# Altium schematic sheet 018_RTC & ID & DEBUG.SchDoc
size 420 x 297 mm; Page Create Date: May 29, 2006; WebSite: https://www.seeedstudio.com; Variant Name: <Core Design>; Page Number: 18; Drawing: qxn; Schematic Name: BeaglePlay; Page Size: A3; Comment: Seeed Title; Page Count: 22; Page Name: 018_RTC & ID & DEBUG; Company: Seeed Studio; RevCode: v0.2; DsnPath: C:\Users\a0488739\Documents\GitHub\beagleplay\allegro\DVT\BEAGLEPLAYV020_220915.DSN; SchematicName: BeaglePlay; PageName: 018_RTC & ID & DEBUG; PageSize: A3; TopSchematic: True
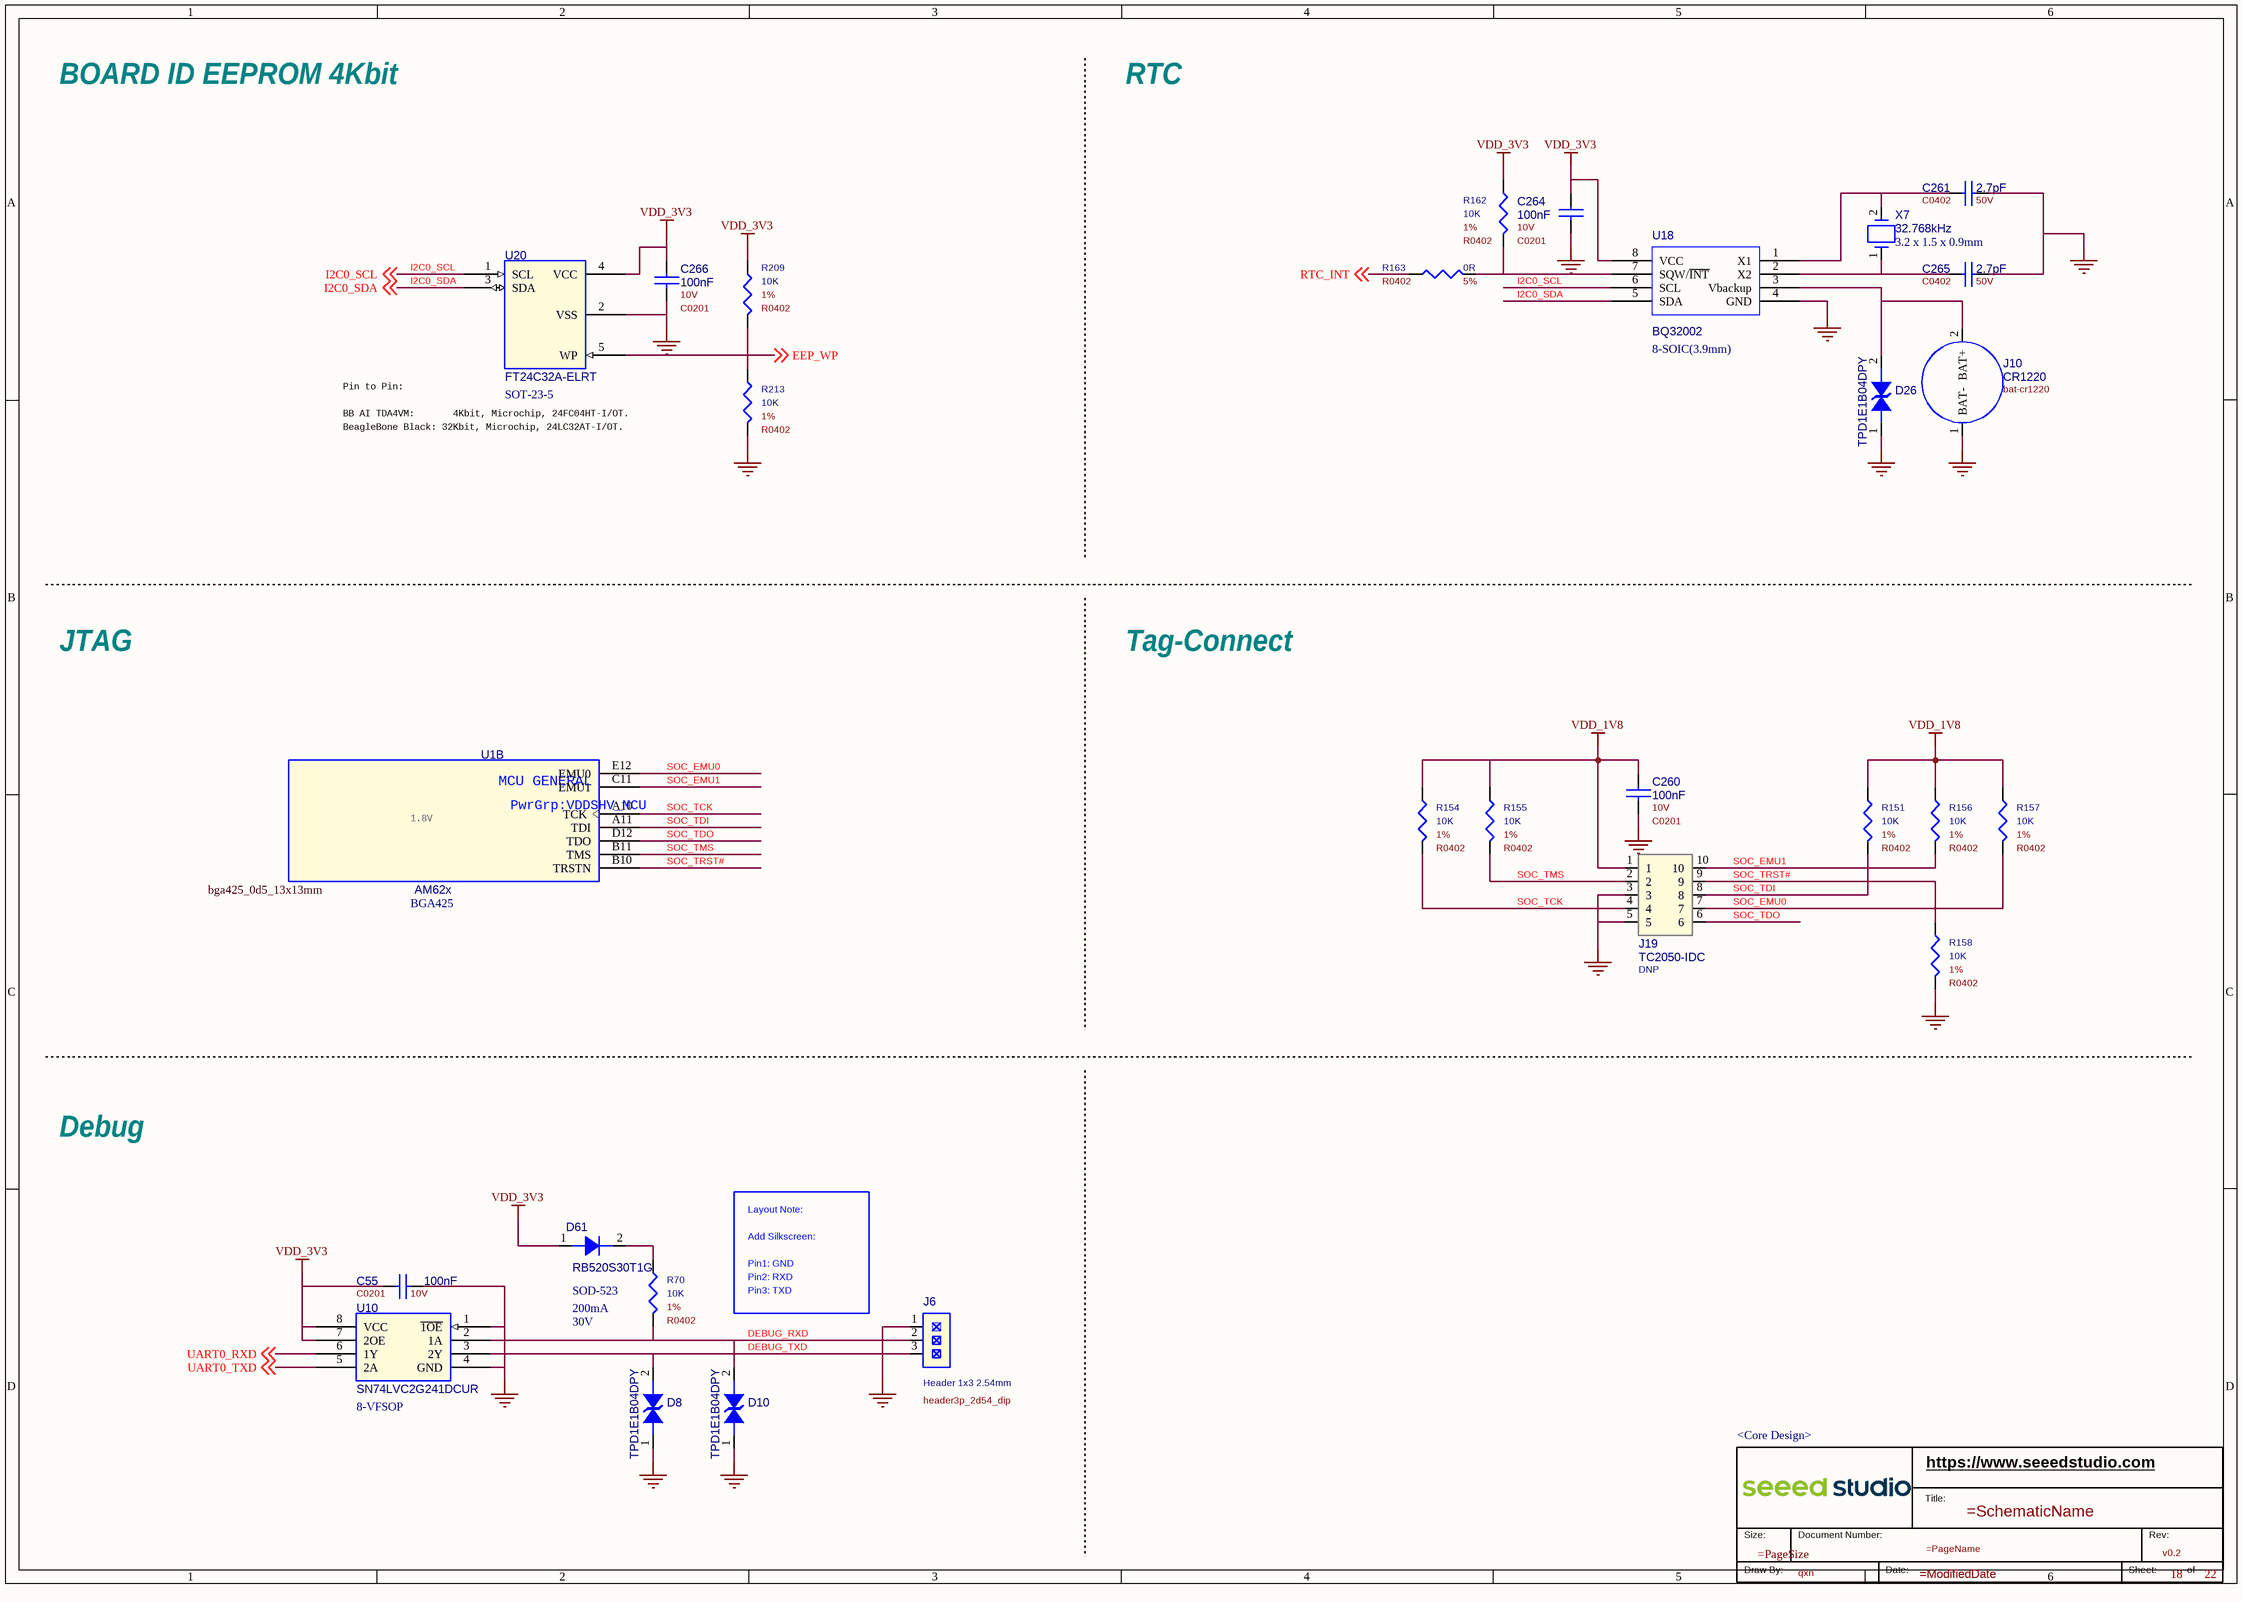
[diagram p0: 018_RTC & ID & DEBUG.SchDoc]

## Parts
*  RevCode: v0.2  Page Number: 18  Page Count: 22  Drawing: qxn  Variant Name: <Core Design>  (hidden comment: Seeed Title)  (graphical)
C55  value 100nF  Rating: 10V  [C0201]  (hidden comment: CC)
C260  value 100nF  Rating: 10V  [C0201]  (hidden comment: CC)
C261  value 2.7pF  Rating: 50V  [C0402]  (hidden comment: CC)
C264  value 100nF  Rating: 10V  [C0201]  (hidden comment: CC)
C265  value 2.7pF  Rating: 50V  [C0402]  (hidden comment: CC)
C266  value 100nF  Rating: 10V  [C0201]  (hidden comment: CC)
D8  value TPD1E1B04DPY  [D0402]  (hidden comment: DIODE TVS BI-DIR)
D10  value TPD1E1B04DPY  [D0402]  (hidden comment: DIODE TVS BI-DIR)
D26  value TPD1E1B04DPY  [D0402]  (hidden comment: DIODE TVS BI-DIR)
D61  value RB520S30T1G  Repetitive Reverse Voltage Maximum: 30V  Peak Forward Current: 200mA  Package Size: SOD-523  [sod_523]  (hidden comment: D)
J6  value Header 1x3 2.54mm  [header3p_2d54_dip]  (hidden comment: Header 1x3)
J10  value CR1220  [bat-cr1220]  (hidden comment: BAT Holder 2P)
J19  value TC2050-IDC  ASSY: DNP  [Connect10_1d27_12_4x6_7mm]  (hidden comment: Header 2X5_1)
R70  value 10K  Rating: 1%  [R0402]  (hidden comment: R)
R151  value 10K  Rating: 1%  [R0402]  (hidden comment: R)
R154  value 10K  Rating: 1%  [R0402]  (hidden comment: R)
R155  value 10K  Rating: 1%  [R0402]  (hidden comment: R)
R156  value 10K  Rating: 1%  [R0402]  (hidden comment: R)
R157  value 10K  Rating: 1%  [R0402]  (hidden comment: R)
R158  value 10K  Rating: 1%  [R0402]  (hidden comment: R)
R162  value 10K  Rating: 1%  [R0402]  (hidden comment: R)
R163  value 0R  Rating: 5%  [R0402]  (hidden comment: R)
R209  value 10K  Rating: 1%  [R0402]  (hidden comment: R)
R213  value 10K  Rating: 1%  [R0402]  (hidden comment: R)
U1  value AM62x  Package Size: BGA425  [bga425_0d5_13x13mm]  (hidden comment: AM62x_BGA425)  (part B of 19)
U10  value SN74LVC2G241DCUR  Package Size: 8-VFSOP  [U_8_DCU]  (hidden comment: SN74LVC2G241)
U18  value BQ32002  Package Size: 8-SOIC(3.9mm)  [soic8_1d27_4_9x3_9mm]  (hidden comment: DS1339_8P)
U20  value FT24C32A-ELRT  Package Size: SOT-23-5  [sot23-5]  (hidden comment: MEM_24LC32_SOT23-5)
X7  value 32.768kHz  Package Size: 3.2 x 1.5 x 0.9mm  [X2_SMD_3_2X1_5MM]  (hidden comment: XTAL_2P)

## Nets
GND: C55.2 C260.2 C261.2 C264.2 C265.2 C266.2 D8.1 D10.1 D26.1 J6.1 J10.1(BAT-) J19.3 J19.5 R158.2 R213.2 U10.1(~{1OE}) U10.4(GND) U18.4(GND) U20.2(VSS)
VDD_1V8: C260.1 J19.1 R151.1 R154.1 R155.1 R156.1 R157.1
VDD_3V3: C55.1 C264.1 C266.1 D61.1(A) R162.1 R209.1 U10.7(2OE) U10.8(VCC) U18.8(VCC) U20.4(VCC)
DEBUG_RXD: D10.2 J6.2 R70.2 U10.2(1A)
DEBUG_TXD: D8.2 J6.3 U10.3(2Y)
EEP_WP: R209.2 R213.1 U20.5(WP) ; off-sheet EEP_WP
I2C0_SCL: U18.6(SCL) U20.1(SCL) ; off-sheet I2C0_SCL
I2C0_SDA: U18.5(SDA) U20.3(SDA) ; off-sheet I2C0_SDA
RTC_INT: R163.1 ; off-sheet RTC_INT
SOC_EMU0: J19.7 R157.2 U1.E12(EMU0)
SOC_EMU1: J19.10 R156.2 U1.C11(EMU1)
SOC_TCK: J19.4 R154.2 U1.A10(TCK)
SOC_TDI: J19.8 R151.2 U1.A11(TDI)
SOC_TDO: J19.6 U1.D12(TDO)
SOC_TMS: J19.2 R155.2 U1.B11(TMS)
SOC_TRST#: J19.9 R158.1 U1.B10(TRSTN)
UART0_RXD: U10.6(1Y) ; off-sheet UART0_RXD
UART0_TXD: U10.5(2A) ; off-sheet UART0_TXD
NetC261_1: C261.1 U18.1(X1) X7.2
NetC265_1: C265.1 U18.2(X2) X7.1
NetD26_2: D26.2 J10.2(BAT+) U18.3(Vbackup)
NetD61_2: D61.2(C) R70.1
NetR162_2: R162.2 R163.2 U18.7(SQW/~{INT})

## Notes on the sheet
- BOARD ID EEPROM 4Kbit
- RTC
- Pin to Pin:
- BB AI TDA4VM:       4Kbit, Microchip, 24FC04HT-I/OT.
- BeagleBone Black: 32Kbit, Microchip, 24LC32AT-I/OT.
- JTAG
- Tag-Connect
- 1.8V
- Debug
- Add Silkscreen:
- Layout Note:
- Pin1: GND
- Pin2: RXD
- Pin3: TXD
- (in symbol AM62x_BGA425, part B) MCU GENERAL; PwrGrp:VDDSHV_MCU
- (in symbol Seeed Title) https://www.seeedstudio.com; Title:; Size:; Document Number:; Rev:; Draw By:; Date:; Sheet:; of

## Library data of the parts
* = Seeed Title: Company: Seeed Studio; WebSite: https://www.seeedstudio.com; Schematic Name: =SchematicName; Page Size: =PageSize; Page Name: =PageName; Page Create Date: May 29, 2006; Page Modify Date: =ModifiedDate
C55 = CC: CAP, Ceramic, SMD, 100nF, 10%, 10V, 0201; Part Reference: C55; Manufacturer: YAGEO; Manufacturer Part Number: CC0201KRX5R6BB104; Company Part Status: ODYSSEY-i.MX8M; PN: 302010271; Temperature Coefficient: X5R; CLASS: DISCRETE; PCB Footprint: C0201; Part Type: Ceramic; Status: ODYSSEY-i.MX8M; Temperature: -55¡ãC to 85¡ãC; Package Size: 0201; Dielectric Type: Ceramic; Tolerance: 10%; Manufacturer PN: CC0201KRX5R6BB104
C260 = CC: CAP, Ceramic, SMD, 100nF, 10%, 10V, 0201; Part Reference: C260; Manufacturer Part Number: CC0201KRX5R6BB104; Manufacturer: YAGEO; Company Part Status: ODYSSEY-i.MX8M; PN: 302010271; Temperature Coefficient: X5R; CLASS: DISCRETE; PCB Footprint: C0201; Temperature: -55¡ãC to 85¡ãC; Status: ODYSSEY-i.MX8M; Part Type: Ceramic; Package Size: 0201; Dielectric Type: Ceramic; Tolerance: 10%; Manufacturer PN: CC0201KRX5R6BB104
C261 = CC: CAP, Ceramic, SMD, 2.7pF, 0.25pF, 50V, 0402; Part Reference: C261; Manufacturer PN: GCM1555C1H2R7CA16D; Manufacturer: Murata; Company Part Status: Combox Pro; Manufacturer Part Number: Murata;GCM1555C1H2R7CA16D; CLASS: DISCRETE; Temperature Coefficient: NP0; PN: 302011569; SIGNAL_MODEL: DEFAULT_CAPACITOR_22.000000pF_1_2; PCB Footprint: C0402; Tolerance: 0.25pF; Dielectric Type: Ceramic; Package Size: 0402; Status: Combox Pro; Part Type: Ceramic
C264 = CC: CAP, Ceramic, SMD, 100nF, 10%, 10V, 0201; Part Reference: C264; Manufacturer PN: CC0201KRX5R6BB104; Manufacturer: YAGEO; Company Part Status: ODYSSEY-i.MX8M; Manufacturer Part Number: Murata;GRM155R71C104KA88D; CLASS: DISCRETE; Temperature Coefficient: X5R; PN: 302010271; SIGNAL_MODEL: DEFAULT_CAPACITOR_100000pF_1_2; PCB Footprint: C0201; Tolerance: 10%; Dielectric Type: Ceramic; Package Size: 0201; Part Type: Ceramic; Status: Combox Pro
C265 = CC: CAP, Ceramic, SMD, 2.7pF, 0.25pF, 50V, 0402; Part Reference: C265; Manufacturer PN: GCM1555C1H2R7CA16D; Manufacturer: Murata; Company Part Status: Combox Pro; Manufacturer Part Number: Murata;GCM1555C1H2R7CA16D; CLASS: DISCRETE; Temperature Coefficient: NP0; PN: 302011569; SIGNAL_MODEL: DEFAULT_CAPACITOR_22.000000pF_1_2; PCB Footprint: C0402; Tolerance: 0.25pF; Dielectric Type: Ceramic; Package Size: 0402; Part Type: Ceramic; Status: Combox Pro
C266 = CC: CAP, Ceramic, SMD, 100nF, 10%, 10V, 0201; Part Reference: C266; Manufacturer PN: CC0201KRX5R6BB104; Company Part Status: ODYSSEY-i.MX8M; Manufacturer: YAGEO; CLASS: DISCRETE; Temperature Coefficient: X5R; PN: 302010271; PCB Footprint: C0201; Tolerance: 10%; Dielectric Type: Ceramic; Package Size: 0201; Manufacturer Part Number: CC0201KRX5R6BB104; Part Type: Ceramic; Status: ODYSSEY-i.MX8M; Temperature: -55¡ãC to 85¡ãC
D8 = DIODE TVS BI-DIR: DIO, ESD, TPD1E1B04DPY, --, 3.6V, --, X1SON(2); Part Reference: D8; Manufacturer: TI; Manufacturer Part Number: TPD1E1B04DPYR/T; Company Part Status: Grove Base Cape for PocketBeagle; Manufacturer PN: TPD1E1B04DPYR; PN: 304050798; CLASS: DISCRETE; PCB Footprint: D0402; Part Type: ESD; Status: Grove Base Cape for PocketBeagle; Temperature: -40¡ãC to 125¡ãC; Package Size: X1SON(2); Rated Voltage: 3.6V
D10 = DIODE TVS BI-DIR: DIO, ESD, TPD1E1B04DPY, --, 3.6V, --, X1SON(2); Part Reference: D10; Manufacturer: TI; Manufacturer Part Number: TPD1E1B04DPYR/T; Company Part Status: Grove Base Cape for PocketBeagle; Manufacturer PN: TPD1E1B04DPYR; PN: 304050798; CLASS: DISCRETE; PCB Footprint: D0402; Part Type: ESD; Status: Grove Base Cape for PocketBeagle; Temperature: -40¡ãC to 125¡ãC; Package Size: X1SON(2); Rated Voltage: 3.6V
D26 = DIODE TVS BI-DIR: DIO, ESD, TPD1E1B04DPY, --, 3.6V, --, X1SON(2); Part Reference: D26; Manufacturer Part Number: TPD1E1B04DPYR/T; Manufacturer: TI; Company Part Status: Grove Base Cape for PocketBeagle; Manufacturer PN: TPD1E1B04DPYR; PN: 304050798; CLASS: DISCRETE; PCB Footprint: D0402; Temperature: -40¡ãC to 125¡ãC; Status: Grove Base Cape for PocketBeagle; Part Type: ESD; Package Size: X1SON(2); Rated Voltage: 3.6V
D61 = D: DIO, Schottky, RB520S30T1G, , , , SOD-523; Part Reference: D61; Manufacturer: ON; Company Part Status: SCG Vehicle Device; CLASS: DISCRETE; PN: 304020782; PCB Footprint: sod_523; Manufacturer PN: RB520S30T1G
J6 = Header 1x3: CONN, Header, 1*3P, DIP; Part Reference: J6; Company Part Status: ST; Manufacturer: Yuxi Electronics; Manufacturer PN: P125-1103A1BS116A1; PN: 320020079; CLASS: IO; PCB Footprint: header3p_2d54_dip; Package Size: 1*3P-2.54-2.54-11.6/3.0mm
J10 = BAT Holder 2P: CONN, BAT Holder, , SMD; Part Reference: J10; Company Part Status: BeagleBone Carrier Board; Manufacturer: HongKeWei; Manufacturer PN: BS-12-B3AA003; PN: 320170000; CLASS: IO; PCB Footprint: bat-cr1220; Package Size: CR1220-15.06*13.00*H4.1mm
J19 = Header 2X5_1: CONN, Header, TC2050-IDC, 2*5P, SMD; Part Reference: J19; Company Part Status: RV PI; PN: TMP-43; CLASS: IO; PCB Footprint: Connect10_1d27_12_4x6_7mm
R70 = R: RES, Thick Film, 10K, 1%, 1/16W, SMD, 0402; Part Reference: R70; Manufacturer PN: RC0402FR-0710KL; Company Part Status: BeagleBone Carrier Board; Manufacturer Part Number: RC0402FR-074K7L; Manufacturer: YAGEO; CLASS: DISCRETE; PN: 301010047; PCB Footprint: R0402; Rated Power: 1/16W; Package Size: 0402; Temperature: -55¡ãC to 155¡ãC; Status: BeagleBone Carrier Board; Part Type: RES
R151 = R: RES, Thick Film, 10K, 1%, 1/16W, SMD, 0402; Part Reference: R151; Manufacturer PN: RC0402FR-0710KL; Company Part Status: BeagleBone Carrier Board; Manufacturer: YAGEO; Manufacturer Part Number: RC0201FR-0710KL; CLASS: DISCRETE; PN: 301010047; PCB Footprint: R0402; Rated Power: 1/16W; Package Size: 0402; Part Type: RES; Status: BeagleBone AI TDA4VM; Temperature: -55¡ãC to 125¡ãC
R154 = R: RES, Thick Film, 10K, 1%, 1/16W, SMD, 0402; Part Reference: R154; Manufacturer: YAGEO; Manufacturer Part Number: RC0402FR-074K7L; Company Part Status: BeagleBone Carrier Board; Manufacturer PN: RC0402FR-0710KL; PN: 301010047; CLASS: DISCRETE; PCB Footprint: R0402; Rated Power: 1/16W; Part Type: RES; Status: BeagleBone Carrier Board; Temperature: -55¡ãC to 155¡ãC; Package Size: 0402
R155 = R: RES, Thick Film, 10K, 1%, 1/16W, SMD, 0402; Part Reference: R155; Manufacturer: YAGEO; Manufacturer Part Number: RC0402FR-074K7L; Company Part Status: BeagleBone Carrier Board; Manufacturer PN: RC0402FR-0710KL; PN: 301010047; CLASS: DISCRETE; PCB Footprint: R0402; Rated Power: 1/16W; Part Type: RES; Status: BeagleBone Carrier Board; Temperature: -55¡ãC to 155¡ãC; Package Size: 0402
R156 = R: RES, Thick Film, 10K, 1%, 1/16W, SMD, 0402; Part Reference: R156; Manufacturer PN: RC0402FR-0710KL; Company Part Status: BeagleBone Carrier Board; Manufacturer: YAGEO; Manufacturer Part Number: RC0201FR-0710KL; CLASS: DISCRETE; PN: 301010047; PCB Footprint: R0402; Rated Power: 1/16W; Package Size: 0402; Part Type: RES; Status: BeagleBone AI TDA4VM; Temperature: -55¡ãC to 125¡ãC
R157 = R: RES, Thick Film, 10K, 1%, 1/16W, SMD, 0402; Part Reference: R157; Manufacturer PN: RC0402FR-0710KL; Company Part Status: BeagleBone Carrier Board; Manufacturer Part Number: RC0201FR-0710KL; Manufacturer: YAGEO; CLASS: DISCRETE; PN: 301010047; PCB Footprint: R0402; Rated Power: 1/16W; Package Size: 0402; Temperature: -55¡ãC to 125¡ãC; Status: BeagleBone AI TDA4VM; Part Type: RES
R158 = R: RES, Thick Film, 10K, 1%, 1/16W, SMD, 0402; Part Reference: R158; Manufacturer PN: RC0402FR-0710KL; Company Part Status: BeagleBone Carrier Board; Manufacturer: YAGEO; Manufacturer Part Number: RC0402FR-074K7L; CLASS: DISCRETE; PN: 301010047; PCB Footprint: R0402; Rated Power: 1/16W; Package Size: 0402; Part Type: RES; Status: BeagleBone Carrier Board; Temperature: -55¡ãC to 155¡ãC
R162 = R: RES, Thick Film, 10K, 1%, 1/16W, SMD, 0402; Part Reference: R162; Manufacturer PN: RC0402FR-0710KL; Manufacturer: YAGEO; Company Part Status: BeagleBone Carrier Board; Manufacturer Part Number: YAGEO;RC0402JR-0710KL; CLASS: DISCRETE; PN: 301010047; SIGNAL_MODEL: DEFAULT_RESISTOR_10000OHM_1_2; PCB Footprint: R0402; Rated Power: 1/16W; Package Size: 0402; Part Type: RES; Status: BeagleBone Carrier Board
R163 = R: RES, Thick Film, 0R, 5%, 1/16W, SMD, 0402; Part Reference: R163; Manufacturer PN: RC0402JR-070RL; Manufacturer: YAGEO; Company Part Status: BeagleBone Carrier Board; Manufacturer Part Number: YAGEO;RC0402JR-070RL; CLASS: DISCRETE; PN: 301010000; SIGNAL_MODEL: DEFAULT_RESISTOR_0.001OHM_1_2; PCB Footprint: R0402; Rated Power: 1/16W; Package Size: 0402; Part Type: RES; Status: BeagleBone Carrier Board
R209 = R: RES, Thick Film, 10K, 1%, 1/16W, SMD, 0402; Part Reference: R209; Manufacturer Part Number: RC0201FR-0710KL; Manufacturer: YAGEO; Company Part Status: BeagleBone Carrier Board; Manufacturer PN: RC0402FR-0710KL; PN: 301010047; CLASS: DISCRETE; PCB Footprint: R0402; Temperature: -55¡ãC to 125¡ãC; Status: BeagleBone AI TDA4VM; Part Type: RES; Package Size: 0402; Rated Power: 1/16W
R213 = R: RES, Thick Film, 10K, 1%, 1/16W, SMD, 0402; Part Reference: R213; Manufacturer PN: RC0402FR-0710KL; Company Part Status: BeagleBone Carrier Board; Manufacturer Part Number: RC0201FR-0710KL; Manufacturer: YAGEO; CLASS: DISCRETE; PN: 301010047; PCB Footprint: R0402; Rated Power: 1/16W; Package Size: 0402; Temperature: -55¡ãC to 125¡ãC; Status: BeagleBone AI TDA4VM; Part Type: RES
U1 = AM62x_BGA425: IC, Controller, MPU, AM62x, BGA425; Part Reference: U1; Manufacturer PN: AM6254ATCGGHALWR; Manufacturer: TI; Company Part Status: BeaglePlay; PN: 310011537; PCB Footprint: bga425_0d5_13x13mm; CLASS: IC
U10 = SN74LVC2G241: IC, Logic, Buffer, SN74LVC2G241DCUR, 8-VFSOP; Part Reference: U10; Manufacturer: TI; Company Part Status: BeagleBone Carrier Board; PN: 310050078; PCB Footprint: U_8_DCU; Temperature: -40¡ãC to 125¡ãC; Status: BeagleBone Carrier Board; Manufacturer Part Number: SN74LVC2G241DCUR; Part Type: Buffer; CLASS: IC; Manufacturer PN: SN74LVC2G241DCUR
U18 = DS1339_8P: IC, Misc, RTC, BQ32002, 8-SOIC(3.9mm); Part Reference: U18; Manufacturer PN: BQ32002DR; Manufacturer: TI; Company Part Status: BeaglePlay; PN: 310110503; PCB Footprint: soic8_1d27_4_9x3_9mm; CLASS: IC
U20 = MEM_24LC32_SOT23-5: IC, Memory Devices, EEPROM, FT24C32A-ELRT, SOT-23-5; Part Reference: U20; Company Part Status: BeagleV-Ahead; Manufacturer: FMD; Manufacturer Part Number: 24FC04HT-I/OT; PN: 310091347; Priority: A; PCB Footprint: sot23-5; Manufacturer PN: FT24C32A-ELRT; CLASS: IC; Part Type: EEPROM; Status: BeagleBone AI TDA4VM; Temperature: -40¡ãC to 85¡ãC
X7 = XTAL_2P: Crystal, SMD, 32.768kHz, 20 ppm, 12.5pF; Part Reference: X7; Manufacturer Part Number: Kyocera;ST3215SB32768H5HPWAA; Company Part Status: BeagleBone Carrier Board; Manufacturer: EPCOS; Manufacturer PN: FC-135 32.7680KA-A3; Rating: 20ppm; PN: 306010138; Frequency Tolerance: 20 ppm; CLASS: DISCRETE; PCB Footprint: X2_SMD_3_2X1_5MM; Status: Combox Pro; Part Type: Crystal